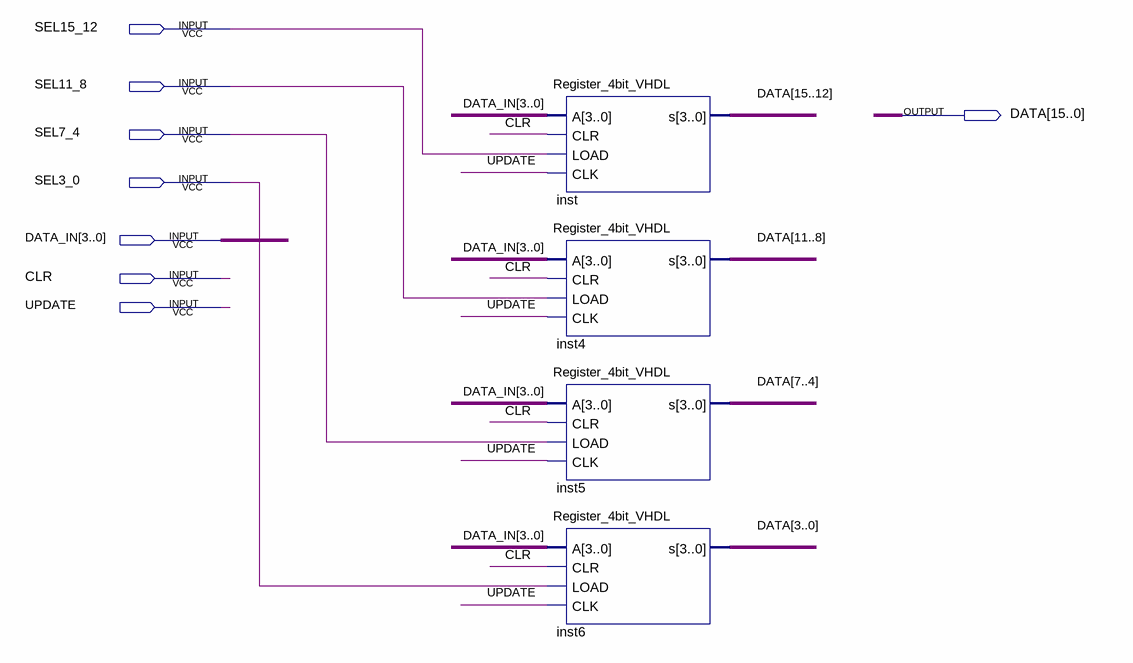
[diagram p0: schematic sheet]
// Quartus schematic DataInput_8switches16bits.bdf as structural Verilog: 4 symbols, 8 pins
module DataInput_8switches16bits (
  input  SEL15_12,
  input  SEL11_8,
  input  SEL7_4,
  input  SEL3_0,
  input  [3:0] DATA_IN,
  input  CLR,
  input  UPDATE,
  output [15:0] DATA
);

  Register_4bit_VHDL inst (.A(DATA_IN), .CLR(CLR), .LOAD(SEL15_12), .CLK(UPDATE), .s(DATA[15:12]));
  Register_4bit_VHDL inst4 (.A(DATA_IN), .CLR(CLR), .LOAD(SEL11_8), .CLK(UPDATE), .s(DATA[11:8]));
  Register_4bit_VHDL inst5 (.A(DATA_IN), .CLR(CLR), .LOAD(SEL7_4), .CLK(UPDATE), .s(DATA[7:4]));
  Register_4bit_VHDL inst6 (.A(DATA_IN), .CLR(CLR), .LOAD(SEL3_0), .CLK(UPDATE), .s(DATA[3:0]));
endmodule
